# EAGLE schematic Arduino charger v1 (EAGLE 6.2)
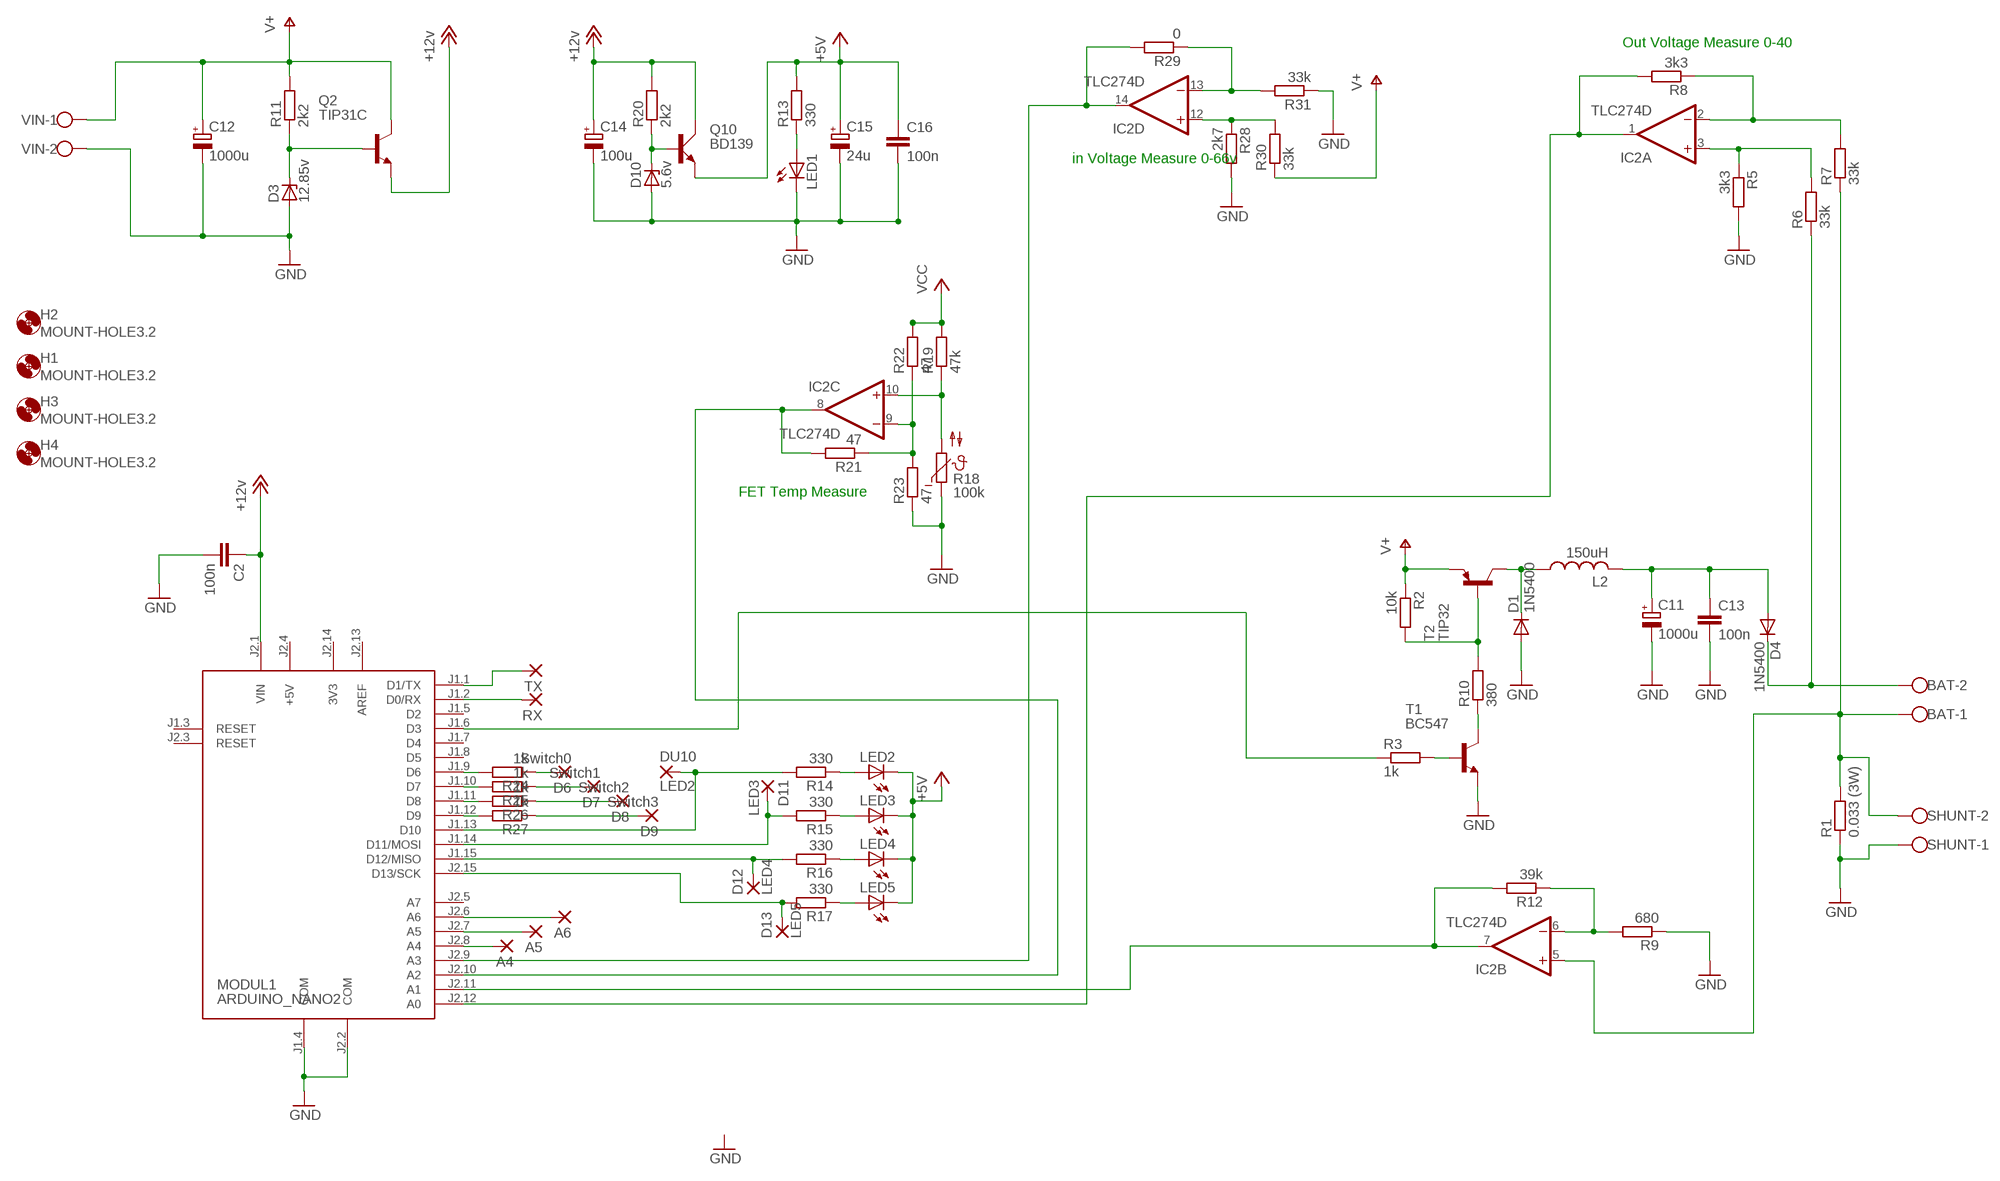
[diagram p0: schematic, sheet 1]

## Parts
A4  1,6/0,9  [1,6/0,9]
A5  1,6/0,9  [1,6/0,9]
A6  1,6/0,9  [1,6/0,9]
BAT  W237-102  [W237-102]
C2  100n  C-EU050-024X044  [C050-024X044]
C11  1000u  CPOL-EUE7.5-18  [E7,5-18]
C12  1000u  CPOL-EUE7.5-18  [E7,5-18]
C13  100n  C-EU050-024X044  [C050-024X044]
C14  100u  CPOL-EUE2.5-5  [E2,5-5]
C15  24u  CPOL-EUE2.5-5  [E2,5-5]
C16  100n  C-EU050-024X044  [C050-024X044]
D1  1N5400  [DO201-15]
D3  12.85v  BZX55  [DO35Z10]
D4  1N5400  [DO201-15]
D6  Switch0  1,6/0,9  [1,6/0,9]
D7  Switch1  1,6/0,9  [1,6/0,9]
D8  Switch2  1,6/0,9  [1,6/0,9]
D9  Switch3  1,6/0,9  [1,6/0,9]
D10  5.6v  BZX55  [DO35Z10]
D11  LED3  1,6/0,9  [1,6/0,9]
D12  LED4  1,6/0,9  [1,6/0,9]
D13  LED5  1,6/0,9  [1,6/0,9]
DU10  LED2  1,6/0,9  [1,6/0,9]
H1  MOUNT-HOLE3.2  [3,2]
H2  MOUNT-HOLE3.2  [3,2]
H3  MOUNT-HOLE3.2  [3,2]
H4  MOUNT-HOLE3.2  [3,2]
IC2  TLC274D  [SO14]
L2  150uH  L-USTJ4-U1  [TJ4-U1]
LED1  LED3MM  [LED3MM]
LED2  LED3MM  [LED3MM]
LED3  LED3MM  [LED3MM]
LED4  LED3MM  [LED3MM]
LED5  LED3MM  [LED3MM]
MODUL1  ARDUINO_NANO2  [ARDUINO_NANO2]
Q2  TIP31C  [TO220]
Q10  BD139  [TO126AV]
R1  0.033 (3W)  R-EU_0922/22  [0922/22]
R2  10k  R-EU_0207/2V  [0207/2V]
R3  1k  R-EU_0207/2V  [0207/2V]
R5  3k3  R-EU_0207/2V  [0207/2V]
R6  33k  R-EU_0207/2V  [0207/2V]
R7  33k  R-EU_0207/2V  [0207/2V]
R8  3k3  R-EU_0207/2V  [0207/2V]
R9  680  R-EU_0207/2V  [0207/2V]
R10  380  R-EU_0613/5V  [P0613V]
R11  2k2  R-EU_0617/17  [0617/17]
R12  39k  R-EU_0207/2V  [0207/2V]
R13  330  R-EU_0207/2V  [0207/2V]
R14  330  R-EU_0207/2V  [0207/2V]
R15  330  R-EU_0207/2V  [0207/2V]
R16  330  R-EU_0207/2V  [0207/2V]
R17  330  R-EU_0207/2V  [0207/2V]
R18  100k  NTC640-9  [N640]
R19  47k  R-EU_0207/2V  [0207/2V]
R20  2k2  R-EU_0207/2V  [0207/2V]
R21  47  R-EU_0207/2V  [0207/2V]
R22  47  R-EU_0207/2V  [0207/2V]
R23  47  R-EU_0207/2V  [0207/2V]
R24  1k  R-EU_0207/2V  [0207/2V]
R25  1k  R-EU_0207/2V  [0207/2V]
R26  1k  R-EU_0207/2V  [0207/2V]
R27  1k  R-EU_0207/2V  [0207/2V]
R28  2k7  R-EU_0207/2V  [0207/2V]
R29  0  R-EU_0207/2V  [0207/2V]
R30  33k  R-EU_0207/2V  [0207/2V]
R31  33k  R-EU_0207/2V  [0207/2V]
RX  1,6/0,9  [1,6/0,9]
SHUNT  W237-102  [W237-102]
T1  BC547  [TO92]
T2  TIP32  [TO220]
TX  1,6/0,9  [1,6/0,9]
VIN  W237-102  [W237-102]

## Nets
+5V: C15.+ C16.1 LED2.K(C) LED3.K(C) LED4.K(C) LED5.K(C) Q10.E R13.2
+12V [Power]: C2.1 C14.+ MODUL1.J2.1(VIN) Q2.3(E) Q10.C R20.2 ; supply symbol labelled +12v
B+ [HighPower]: BAT.2 D4.C R6.1
B- [HighPower]: BAT.1 IC2.5(B:+IN) R1.2 R7.1 SHUNT.2
GND [HighPower]: C2.2 C11.- C12.- C13.2 C14.- C15.- C16.2 D1.A D3.A D10.A LED1.K(C) MODUL1.J1.4(COM) MODUL1.J2.2(COM) R1.1 R5.2 R9.1 R18.1 R23.1 R28.2 R31.1 SHUNT.1 T1.1(E) VIN.2
N$1: D3.C Q2.1(B) R11.1
N$2 [HighPower]: D1.C L2.1 T2.2(C)
N$3: IC2.12(D:+IN) R28.1 R30.2
N$4: MODUL1.J1.6(D3) R3.1
N$5: A4.1(P) MODUL1.J2.8(A4)
N$6: MODUL1.J1.1(D1/TX) TX.1(P)
N$7: D10.C Q10.B R20.1
N$8: MODUL1.J1.9(D6) R24.2
N$9: R3.2 T1.2(B)
N$10: R10.1 T1.3(C)
N$11: IC2.6(B:-IN) R9.2 R12.1
N$12: MODUL1.J1.10(D7) R25.2
N$14: MODUL1.J1.11(D8) R26.2
N$15: MODUL1.J1.12(D9) R27.2
N$16: A5.1(P) MODUL1.J2.7(A5)
N$17: A6.1(P) MODUL1.J2.6(A6)
N$18: MODUL1.J1.2(D0/RX) RX.1(P)
N$20 [HighPower]: C11.+ C13.1 D4.A L2.2
N$21: D13.1(P) MODUL1.J2.15(D13/SCK) R17.2
N$22: D12.1(P) MODUL1.J1.15(D12/MISO) R16.2
N$23 [Power]: R2.2 R10.2 T2.1(B)
N$24: IC2.3(A:+IN) R5.1 R6.2
N$26: IC2.7(B:OUT) MODUL1.J2.11(A1) R12.2
N$27: IC2.2(A:-IN) R7.2 R8.1
N$28: IC2.1(A:OUT) MODUL1.J2.12(A0) R8.2
N$29: LED1.A R13.1
N$30: LED2.A R14.1
N$31: LED3.A R15.1
N$33: IC2.8(C:OUT) MODUL1.J2.10(A2) R21.2
N$34: LED4.A R16.1
N$35: LED5.A R17.1
N$39: IC2.9(C:-IN) R21.1 R22.1 R23.2
N$41: DU10.1(P) MODUL1.J1.13(D10) R14.2
N$44: D11.1(P) MODUL1.J1.14(D11/MOSI) R15.2
N$46: IC2.10(C:+IN) R18.2 R19.1
N$48: IC2.13(D:-IN) R29.1 R31.2
N$53: IC2.14(D:OUT) MODUL1.J2.9(A3) R29.2
N$54: D6.1(P) R24.1
N$55: D7.1(P) R25.1
N$56: D8.1(P) R26.1
N$57: D9.1(P) R27.1
V+ [HighPower]: C12.+ Q2.2(C) R2.1 R11.2 R30.1 T2.3(E) VIN.1
VCC [Power]: R19.2 R22.2
Unconnected: MODUL1.J1.3(RESET) MODUL1.J1.5(D2) MODUL1.J1.7(D4) MODUL1.J1.8(D5) MODUL1.J2.3(RESET) MODUL1.J2.5(A7)

## Notes on the sheet
- Out Voltage Measure 0-40
- in Voltage Measure 0-66v
- FET Temp Measure

## Power pins joined to a net without a drawn wire
3V3: MODUL1.J2.14(3V3)
+5V: MODUL1.J2.4(+5V)
AREF: MODUL1.J2.13(AREF)
V+: IC2.4(P:V+)
V-: IC2.11(P:V-)

## Library data of the parts
A4-A6 D6-D9 D11-D13 DU10 RX TX = wirepad:1,6/0,9: THROUGH-HOLE PAD
BAT SHUNT VIN = con-wago-500:W237-102: WAGO SCREW CLAMP; MPN: 237-102; OC_FARNELL: unknown; OC_NEWARK: 70K9898
C2 C13 C16 = rcl:C-EU: CAPACITOR, European symbol
C11 C12 C14 C15 = rcl:CPOL-EU: POLARIZED CAPACITOR, European symbol
D1 D4 = diode:1N5400: DIODE standard rectifier, 3 A, 50 V (Motorola)
D3 D10 = diode:BZX55: Z DIODE
H1-H4 = holes:MOUNT-HOLE: MOUNTING HOLE with drill center marker
IC2 = linear:TLC274: OP AMP
L2 = rcl:L-US: INDUCTOR, American symbol
LED1-LED5 = led:LED: LED OSRAM: - CHIPLED LG R971, LG N971, LY N971, LG Q971, LY Q971, LO R971, LY R971 LH N974, LH R974 LS Q976, LO Q976, LY Q976 LO Q996 - Hyper CHIPLED LW Q18S LB Q993, LB Q99A, LB R99A - SideLED LS A670, LO A670, LY A670, LG A670, LP A670 LB A673, LV A673, LT A673, LW A673 LH A674 LY A675 LS A676, LA A676, LO A676, LY A676, LW A676 LS A679, LY A679, LG A679 - Hyper Micro SIDELED® LS Y876, LA Y876, LO Y876, LY Y876 LT Y87S - SmartLED LW L88C, LW L88S LB L89C, LB L89S, LG L890 LS L89K, LO L89K, LY L89K LS L896, LA L896, LO L896, LY L896 - TOPLED LS T670, LO T670, LY T670, LG T670, LP T670 LSG T670, LSP T670, LSY T670, LOP T670, LYG T670 LG T671, LOG T671, LSG T671 LB T673, LV T673, LT T673, LW T673 LH T674 LS T676, LA T676, LO T676, LY T676, LB T676, LH T676, LSB T676, LW T676 LB T67C, LV T67C, LT T67C, LS T67K, LO T67K, LY T67K, LW E67C LS E67B, LA E67B, LO E67B, LY E67B, LB E67C, LV E67C, LT E67C LW T67C LS T679, LY T679, LG T679 LS T770, LO T770, LY T770, LG T770, LP T770 LB T773, LV T773, LT T773, LW T773 LH T774 LS E675, LA E675, LY E675, LS T675 LS T776, LA T776, LO T776, LY T776, LB T776 LHGB T686 LT T68C, LB T68C - Hyper Mini TOPLED® LB M676 - Mini TOPLED Santana® LG M470 LS M47K, LO M47K, LY M47K Source: http://www.osram.convergy.de LUXEON: - LUMILED® LXK2-PW12-R00, LXK2-PW12-S00, LXK2-PW14-U00, LXK2-PW14-V00 LXK2-PM12-R00, LXK2-PM12-S00, LXK2-PM14-U00 LXK2-PE12-Q00, LXK2-PE12-R00, LXK2-PE12-S00, LXK2-PE14-T00, LXK2-PE14-U00 LXK2-PB12-K00, LXK2-PB12-L00, LXK2-PB12-M00, LXK2-PB14-N00, LXK2-PB14-P00, LXK2-PB14-Q00 LXK2-PR12-L00, LXK2-PR12-M00, LXK2-PR14-Q00, LXK2-PR14-R00 LXK2-PD12-Q00, LXK2-PD12-R00, LXK2-PD12-S00 LXK2-PH12-R00, LXK2-PH12-S00 LXK2-PL12-P00, LXK2-PL12-Q00, LXK2-PL12-R00 Source: www.luxeon.com KINGBRIGHT: KA-3528ASYC Source: www.kingbright.com
MODUL1 = arduino:ARDUINO_NANO2: Arduino Nano2 Auto generated by modulcreator.ulp \;; ANZAHL: 2; MODUL: TRUE; STECKX0: -76200; STECKX1: 76200; STECKY0: 177800; STECKY1: 177800
Q2 = transistor-npn:TIP31C*: NPN Transistor
Q10 = transistor-power:BD139: NPN TRANSISTOR
R1-R3 R5-R17 R19-R31 = rcl:R-EU_: RESISTOR, European symbol
R18 = ptc-ntc:NTC640-9: PHILIPS NTC
T1 = transistor:BC547: NPN TRANSISTOR
T2 = transistor:TIP32: PNP Transistor Medium Power Linear Switching Applications Source: http://onsemi.com

## Net classes
1 Power: width 0.5 mm
2 HighPower: width 1 mm